# EAGLE design C64_Joyswitch_RF (EAGLE 9.5.2)
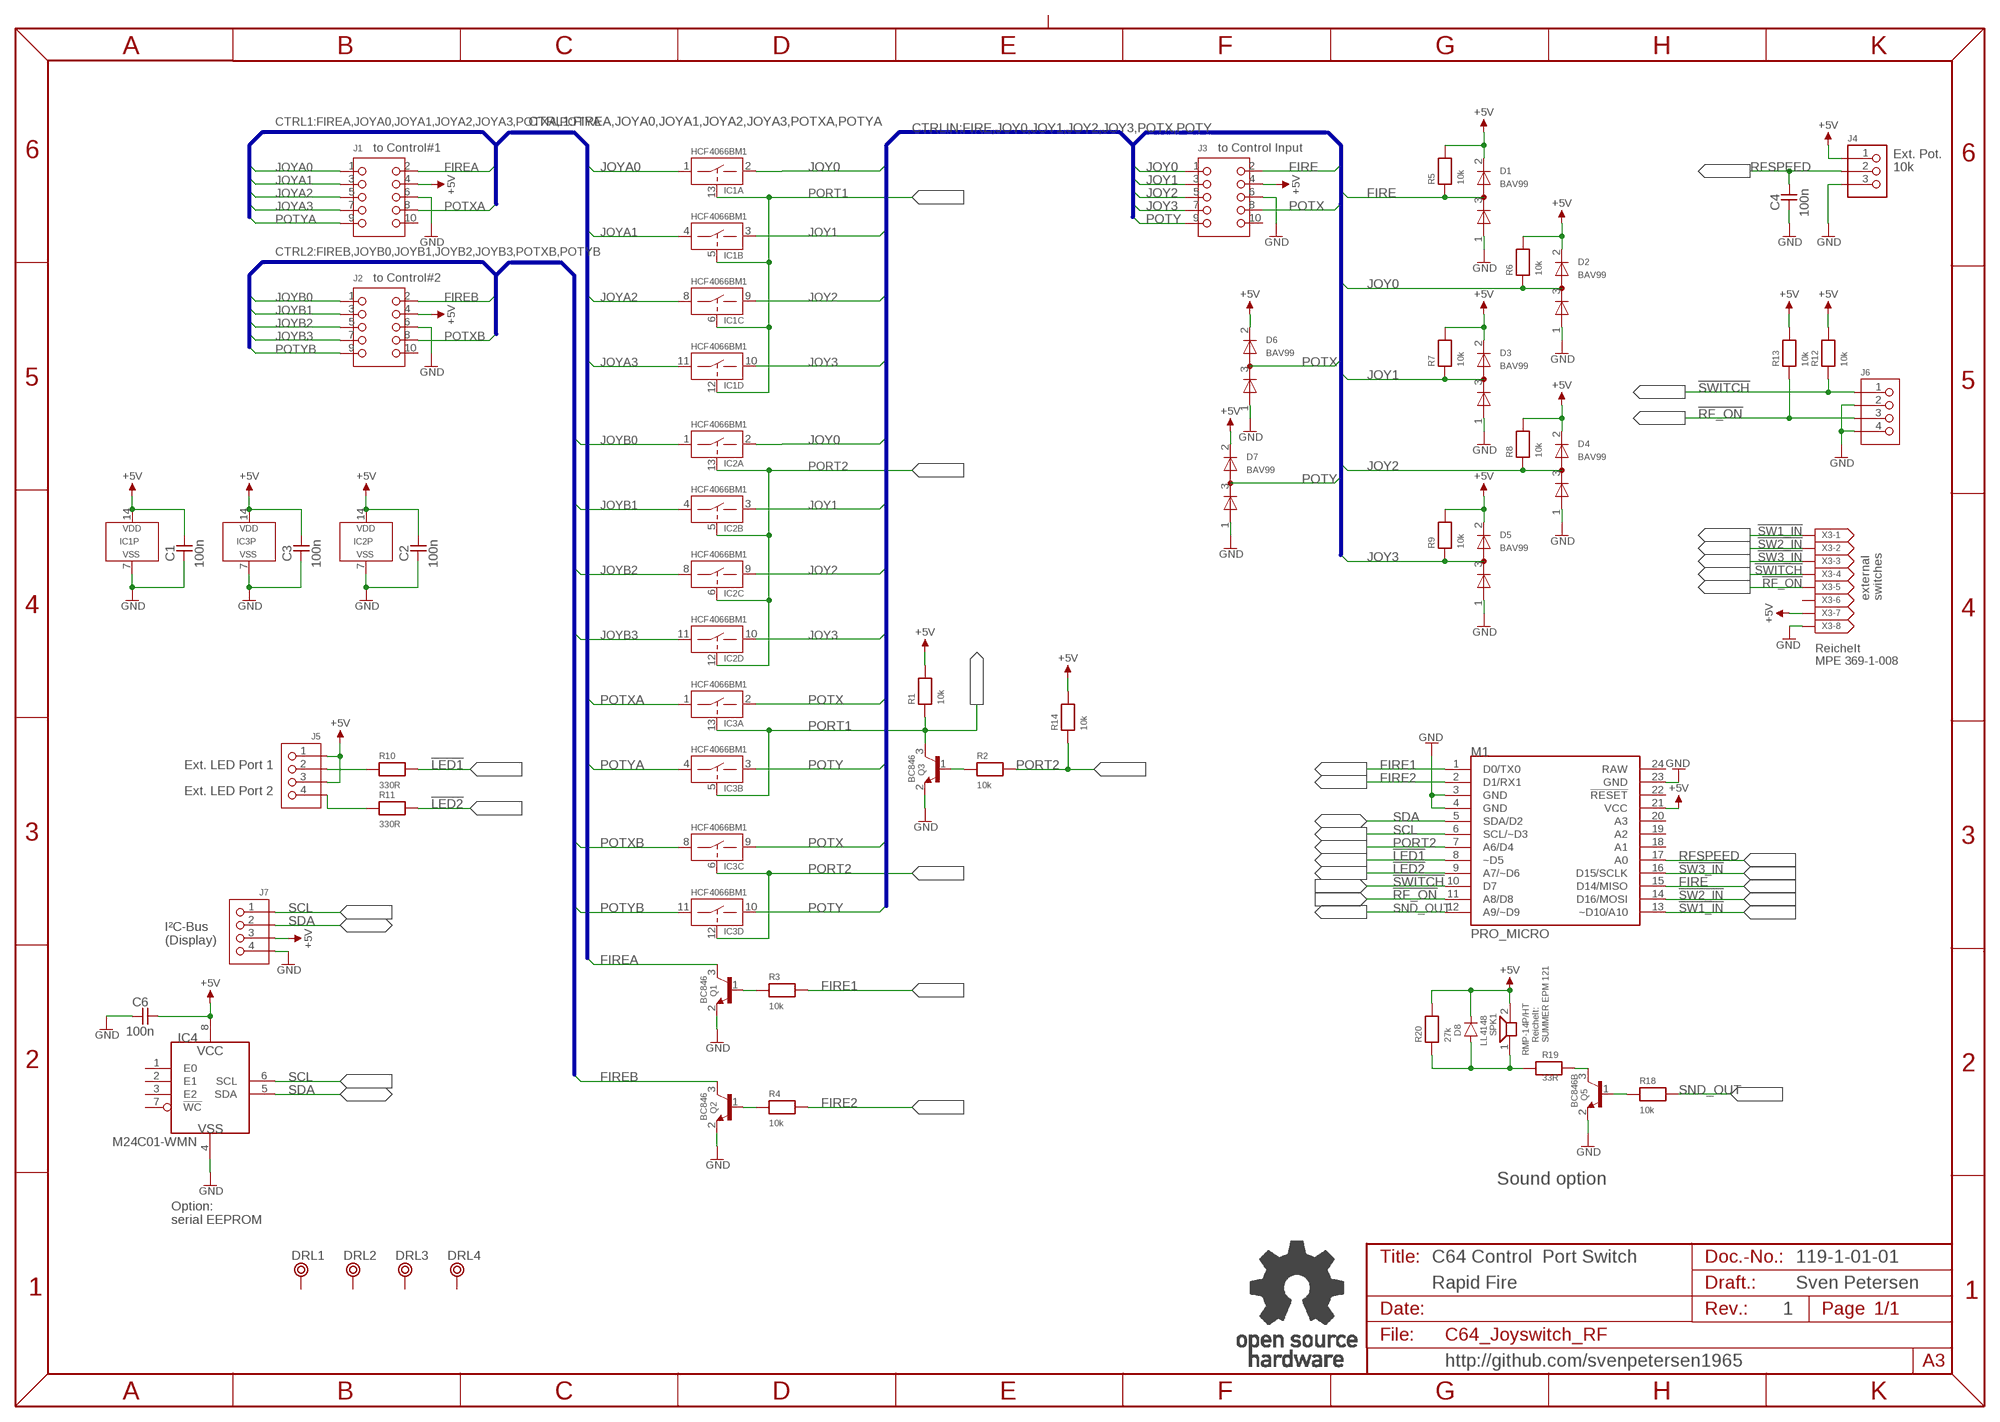
[diagram p0: schematic, sheet 1]

## Parts
C1  100n  C-0805  [0805]
C2  100n  C-0805  [0805]
C3  100n  C-0805  [0805]
C4  100n  C-0805  [0805]
C6  100n  C-0805  [0805]
D1  BAV99  D-BAV99  [SOT23]
D2  BAV99  D-BAV99  [SOT23]
D3  BAV99  D-BAV99  [SOT23]
D4  BAV99  D-BAV99  [SOT23]
D5  BAV99  D-BAV99  [SOT23]
D6  BAV99  D-BAV99  [SOT23]
D7  BAV99  D-BAV99  [SOT23]
D8  LL4148  [SOD80C]
DRL1  BOHR3,1  [BOHR3,1]
DRL2  BOHR3,1  [BOHR3,1]
DRL3  BOHR3,1  [BOHR3,1]
DRL4  BOHR3,1  [BOHR3,1]
IC1  HCF4066BM1  4066  [SO-14]
IC2  HCF4066BM1  4066  [SO-14]
IC3  HCF4066BM1  4066  [SO-14]
IC4  M24C01-WMN  M24CXX-WMN  [SO-08]
J1  2X05WV  [2X05WV]
J2  2X05WV  [2X05WV]
J3  2X05WV  [2X05WV]
J4  6410-3P  [6410-3P]
J5  6410-4P  [6410-4P]
J6  6410-4P  [6410-4P]
J7  6410-4P  [6410-4P]
M1  PRO_MICRO  [PRO_MICRO]
Q1  BC846  [SOT23]
Q2  BC846  [SOT23]
Q3  BC846  [SOT23]
Q5  BC846B  BC846  [SOT23]
R1  10k  R-0805  [0805]
R2  10k  R-0805  [0805]
R3  10k  R-0805  [0805]
R4  10k  R-0805  [0805]
R5  10k  R-0805  [0805]
R6  10k  R-0805  [0805]
R7  10k  R-0805  [0805]
R8  10k  R-0805  [0805]
R9  10k  R-0805  [0805]
R10  330R  R-0805  [0805]
R11  330R  R-0805  [0805]
R12  10k  R-0805  [0805]
R13  10k  R-0805  [0805]
R14  10k  R-0805  [0805]
R18  10k  R-0805  [0805]
R19  33R  R-0805  [0805]
R20  27k  R-0805  [0805]
SPK1  RMP-14P/HT  [RMP-14P/HT]
U$94  OPEN_SOURCE_HW  [OPENHW]
X3  369-1-008  MICMA08B  [MICMA08B]

## Nets
!LED1: M1.8(~D5) R10.2
!LED2: M1.9(A7/~D6) R11.2
!RF_ON: J6.3 M1.11(A8/D8) R13.1 X3.5
!SW1_IN: M1.13(~D10/A10) X3.1
!SW2_IN: M1.14(D16/MOSI) X3.2
!SW3_IN: M1.16(D15/SCLK) X3.3
!SWITCH: J6.1 M1.10(D7) R12.1 X3.4
+5V: C1.2 C2.2 C3.2 C6.2 D1.2(K) D2.2(K) D3.2(K) D4.2(K) D5.2(K) D6.2(K) D7.2(K) D8.K IC1.14(P:VDD) IC2.14(P:VDD) IC3.14(P:VDD) IC4.8(VCC) J1.4 J2.4 J3.4 J4.1 J5.1 J5.3 J7.3 M1.21(VCC) R1.2 R5.2 R6.2 R7.2 R8.2 R9.2 R12.2 R13.2 R14.2 R20.2 SPK1.2 X3.7
FIRE: D1.3(KA) J3.2 M1.15(D14/MISO) R5.1
FIRE1: M1.1(D0/TX0) R3.2
FIRE2: M1.2(D1/RX1) R4.2
FIREA: J1.2 Q1.3(C)
FIREB: J2.2 Q2.3(C)
GND: C1.1 C2.1 C3.1 C4.1 C6.1 D1.1(A) D2.1(A) D3.1(A) D4.1(A) D5.1(A) D6.1(A) D7.1(A) IC1.7(P:VSS) IC2.7(P:VSS) IC3.7(P:VSS) IC4.4(VSS) J1.6 J2.6 J3.6 J4.3 J6.2 J6.4 J7.4 M1.3(GND) M1.4(GND) M1.23(GND) Q1.2(E) Q2.2(E) Q3.2(E) Q5.2(E) X3.8
JOY0: D2.3(KA) IC1.2(A:B) IC2.2(A:B) J3.1 R6.1
JOY1: D3.3(KA) IC1.3(B:B) IC2.3(B:B) J3.3 R7.1
JOY2: D4.3(KA) IC1.9(C:B) IC2.9(C:B) J3.5 R8.1
JOY3: D5.3(KA) IC1.10(D:B) IC2.10(D:B) J3.7 R9.1
JOYA0: IC1.1(A:A) J1.1
JOYA1: IC1.4(B:A) J1.3
JOYA2: IC1.8(C:A) J1.5
JOYA3: IC1.11(D:A) J1.7
JOYB0: IC2.1(A:A) J2.1
JOYB1: IC2.4(B:A) J2.3
JOYB2: IC2.8(C:A) J2.5
JOYB3: IC2.11(D:A) J2.7
N$2: Q3.1(B) R2.1
N$3: Q1.1(B) R3.1
N$4: Q2.1(B) R4.1
N$5: J5.2 R10.1
N$6: J5.4 R11.1
N$8: Q5.1(B) R18.1
N$9: Q5.3(C) R19.2
N$10: D8.A R19.1 R20.1 SPK1.1
PORT1: IC1.5(B:EN) IC1.6(C:EN) IC1.12(D:EN) IC1.13(A:EN) IC3.5(B:EN) IC3.13(A:EN) Q3.3(C) R1.1
PORT2: IC2.5(B:EN) IC2.6(C:EN) IC2.12(D:EN) IC2.13(A:EN) IC3.6(C:EN) IC3.12(D:EN) M1.7(A6/D4) R2.2 R14.1
POTX: D6.3(KA) IC3.2(A:B) IC3.9(C:B) J3.8
POTXA: IC3.1(A:A) J1.8
POTXB: IC3.8(C:A) J2.8
POTY: D7.3(KA) IC3.3(B:B) IC3.10(D:B) J3.9
POTYA: IC3.4(B:A) J1.9
POTYB: IC3.11(D:A) J2.9
RFSPEED: C4.2 J4.2 M1.17(A0)
SCL: IC4.6(SCL) J7.1 M1.6(SCL/~D3)
SDA: IC4.5(SDA) J7.2 M1.5(SDA/D2)
SND_OUT: M1.12(A9/~D9) R18.2
Unconnected: DRL1.P$1 DRL2.P$1 DRL3.P$1 DRL4.P$1 IC4.1(E0) IC4.2(E1) IC4.3(E2) IC4.7(!WC) J1.10 J2.10 J3.10 M1.18(A1) M1.19(A2) M1.20(A3) M1.22(!RESET) X3.6

## Buses
CTRL1:FIREA,JOYA0,JOYA1,JOYA2,JOYA3,POTXA,POTYA
CTRL2:FIREB,JOYB0,JOYB1,JOYB2,JOYB3,POTXB,POTYB
CTRLIN:FIRE,JOY0,JOY1,JOY2,JOY3,POTX,POTY

## Notes on the sheet
- to Control#1 | to Control Input
- Ext. Pot.
- 10k
- to Control#2
- external
  switches
- Reichelt
  MPE 369-1-008
- Ext. LED Port 1
- Ext. LED Port 2
- I²C-Bus
  (Display)
- Reichelt:
  SUMMER EPM 121
- Sound option
- Option:
  serial EEPROM
- C64 Control  Port Switch | 119-1-01-01
- Rapid Fire | Sven Petersen
- 1
- http://github.com/svenpetersen1965

## Power pins joined to a net without a drawn wire
RAW: M1.24(RAW)

## Library data of the parts
C1-C4 C6 = SMD:C-0805
D1-D7 = Dioden:D-BAV99
D8 = Dioden:LL4148
DRL1-DRL4 = Mech_Bohr:BOHR3,1
IC1-IC3 = 40XXSMD:4066: Quadruple bilateral switches
IC4 = ST:M24CXX-W
J1-J3 = PINHEAD:2X05WV
J4 = MOLEX:6410-3P: 6410/22-27-2031
J5-J7 = MOLEX:6410-4P: 6410/22-27-2041
M1 = Arduino:PRO_MICRO
Q1-Q3 Q5 = Transistoren:BC846
R1-R14 R18-R20 = SMD:R-0805
SPK1 = KM:RMP-14P/HT
U$94 = Logo:OPEN_SOURCE_HW
X3 = AMP:MICMA08B

## Board
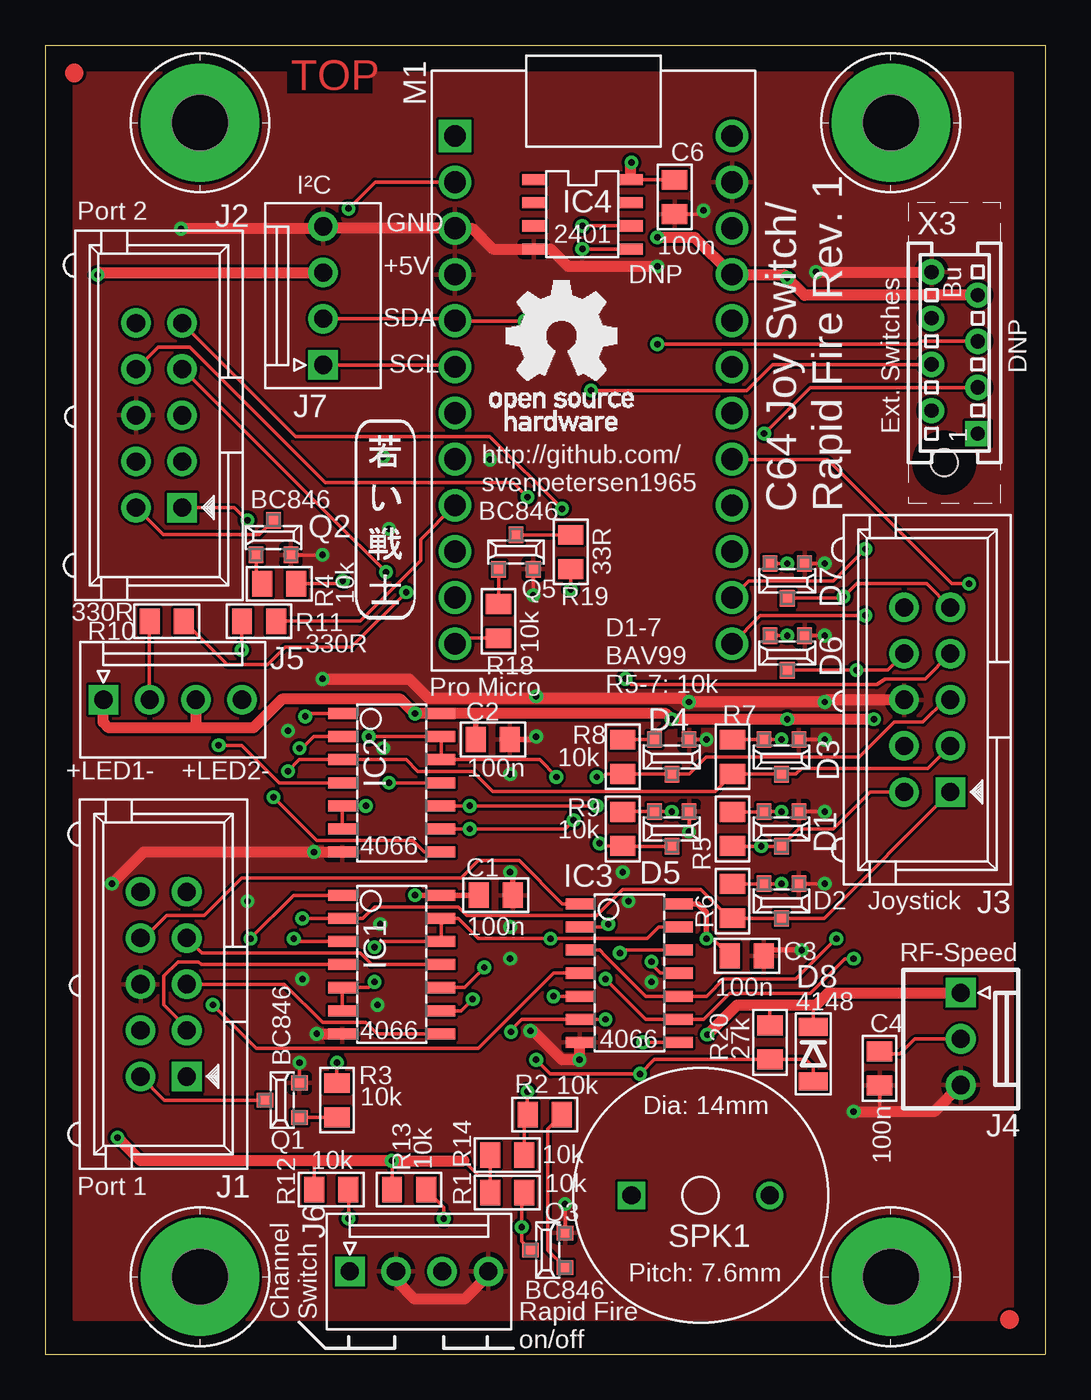
[diagram p1: board, top side]
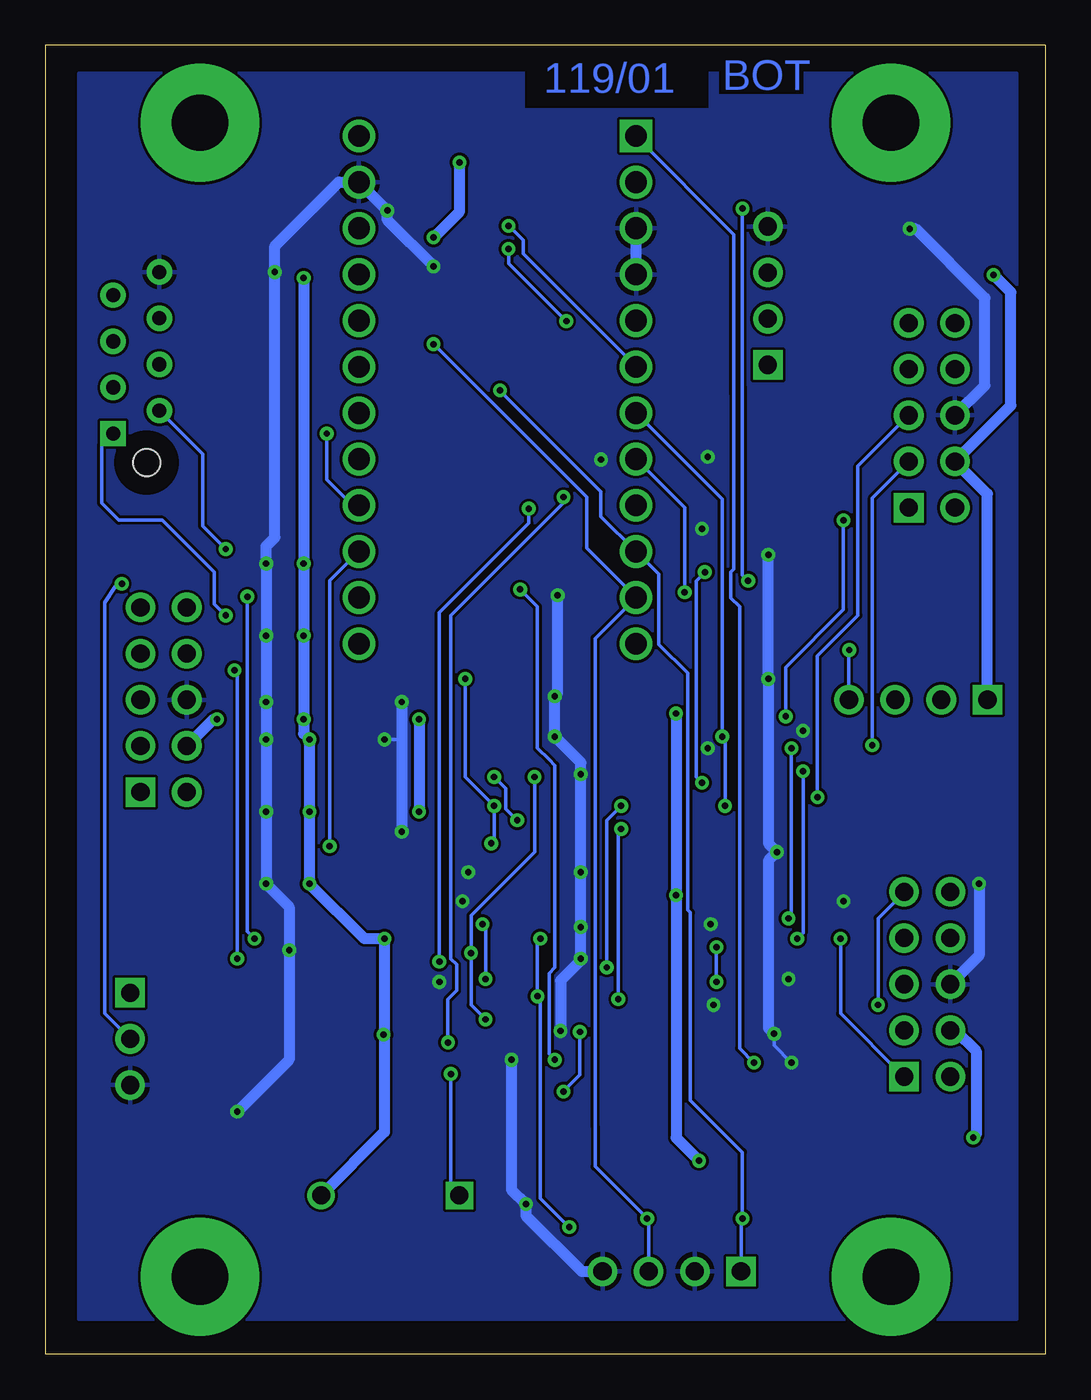
[diagram p2: board, bottom side, seen from below]

Size 55 x 72 mm. Coordinates in mm from the lower left corner, seen from the top.
Outline: 0,0 55,0 55,72 0,72 0,0
Copper layers (1*16): Top 0.035mm / dielectric 1.5mm / Bottom 0.035mm
Design rules "default *": minimum track width 6mil, minimum drill 0.35mm, track to track 6mil, track to pad 6mil, pad to pad 6mil, via to via 6mil, smd to smd 6mil, copper to edge 40mil, drill to drill 6mil, minimum pad ring 10mil, minimum via ring 8mil, stop-mask expansion 4mil, vias tented up to drill 24mil, thermal gap 10mil
bRestrict: 3 lines

### Footprints (pad centres in the part's own frame; a part is rotated, then mirrored left to right if it is on the bottom)
0805 = smd 1.092 x 1.397: 1 -0.94,0; 2 0.94,0
SOT23 = smd 0.8 x 0.9: 1 -0.953,-0.953; 2 0.953,-0.953; 3 0,0.953
SOD80C = smd 1 x 1.6: A -1.5,0; K 1.5,0
BOHR3,1 = drill 3.1 pad 6.502: P$1 0,0
SO-14 = smd 0.61 x 1.524: 1 -3.81,-2.731; 2 -2.54,-2.731; 3 -1.27,-2.731; 4 0,-2.731; 5 1.27,-2.731; 6 2.54,-2.731; 7 3.81,-2.731; 8 3.81,2.731; 9 2.54,2.731; 10 1.27,2.731; 11 0,2.731; 12 -1.27,2.731; 13 -2.54,2.731; 14 -3.81,2.731
SO-08 = smd 0.61 x 1.295: 1 -1.905,-2.667; 2 -0.635,-2.667; 3 0.635,-2.667; 4 1.905,-2.667; 5 1.905,2.667; 6 0.635,2.667; 7 -0.635,2.667; 8 -1.905,2.667
2X05WV = drill 1 pad 1.626 square: 1 -5.08,-1.27 | drill 1 pad 1.626: 2 -5.08,1.27; 3 -2.54,-1.27; 4 -2.54,1.27; 5 0,-1.27; 6 0,1.27; 7 2.54,-1.27; 8 2.54,1.27; 9 5.08,-1.27; 10 5.08,1.27
6410-3P = drill 1 pad 1.626 square: 1 -2.54,0 | drill 1 pad 1.626: 2 0,0; 3 2.54,0
6410-4P = drill 1 pad 1.626 square: 1 -3.81,0 | drill 1 pad 1.626: 2 -1.27,0; 3 1.27,0; 4 3.81,0
PRO_MICRO = drill 1.2 square: 1 -7.62,13.97 | drill 1.2: 2 -7.62,11.43; 3 -7.62,8.89; 4 -7.62,6.35; 5 -7.62,3.81; 6 -7.62,1.27; 7 -7.62,-1.27; 8 -7.62,-3.81; 9 -7.62,-6.35; 10 -7.62,-8.89; 11 -7.62,-11.43; 12 -7.62,-13.97; 13 7.62,-13.97; 14 7.62,-11.43; 15 7.62,-8.89; 16 7.62,-6.35; 17 7.62,-3.81; 18 7.62,-1.27; 19 7.62,1.27; 20 7.62,3.81; 21 7.62,6.35; 22 7.62,8.89; 23 7.62,11.43; 24 7.62,13.97
RMP-14P/HT = drill 1 square: 1 0,3.8 | drill 1: 2 0,-3.8
MICMA08B = drill 0.787 pad 1.397 square: 1 4.445,1.27 | drill 0.787 pad 1.397: 2 3.175,-1.27; 3 1.905,1.27; 4 0.635,-1.27; 5 -0.635,1.27; 6 -1.905,-1.27; 7 -3.175,1.27; 8 -4.445,-1.27 | hole 1.5: 6.032,-0.568

### Placement (x,y rotation side)
C1  24.77,25.24 180 top
C2  24.61,33.81 180 top
C3  38.58,21.91 180 top
C4  45.88,15.72 90 top
C6  34.61,63.66 90 top
D1  40.48,28.89 180 top
D2  40.48,24.92 180 top
D3  40.48,32.86 180 top
D4  34.45,32.86 180 top
D5  34.45,28.89 180 top
D6  40.8,38.58 180 top
D7  40.8,42.55 180 top
D8  42.23,16.51 90 top
DRL1  8.5,4.25 0 top
DRL2  46.5,4.25 0 top
DRL3  46.5,67.75 0 top
DRL4  8.5,67.75 0 top
IC1  19.05,21.43 270 top
IC2  19.05,31.43 270 top
IC3  32.12,20.96 270 top
IC4  29.53,62.71 270 top
J1  6.5,20.35 90 top
J2  6.25,51.65 90 top
J3  48.5,36 90 top
J4  50.34,17.34 270 top
J5  7,36 0 top
J6  20.55,4.55 0 top
J7  15.27,58.23 90 top
M1  30.14,53.05 0 top
Q1  13.02,13.97 90 top
Q2  12.54,44.93 0 top
Q3  27.62,5.71 90 top
Q5  25.88,44.13 0 top
R1  25.4,8.89 180 top
R2  27.46,13.18 180 top
R3  16.03,13.97 90 top
R4  12.86,42.39 0 top
R5  37.78,28.89 90 top
R6  37.78,24.92 90 top
R7  37.78,32.86 90 top
R8  31.75,32.86 90 top
R9  31.75,28.89 90 top
R10  6.67,40.32 0 top
R11  11.75,40.32 0 top
R12  15.72,9.05 180 top
R13  20,9.05 180 top
R14  25.4,10.95 180 top
R18  24.92,40.32 270 top
R19  28.89,44.13 90 top
R20  39.85,17.14 90 top
SPK1  36.04,8.73 90 top
U$65  [2LAYER]  13.49,69.53 0 top
U$66  [SMD_REF_R1MM]  1.59,70.48 0 top
U$67  [SMD_REF_R1MM]  53.02,1.91 0 top
U$68  [PCB-TITLE/]  0.16,81.6 0 top  (outside the outline)
U$93  [SVEN_TAG]  18.73,46.04 0 top
U$94  24.45,50.8 0 top
X3  50.01,55.09 270 top

### Tracks (layer width: path | path; a pad name or v marks a point on that pad's centre or on a via)
!LED1  (via drill 0.35)
  Top 0.203: R10.2 9.99,37.94 12.22,37.94 13.18,38.89 16.83,38.89 v19.84,41.91
  Bottom 0.203: v19.84,41.91 19.84,46.56 M1.8
!LED2
  Top 0.203: R11.2 17.3,40.32 20.64,43.66 20.64,44.82 M1.9
!RF_ON  (via drill 0.35)
  Top 0.203: v21.91,7.46 21.91,8.08 R13.1 | X3.5 48.1,55.72 47.94,55.56 v33.66,55.56
  Bottom 0.203: J6.3 21.82,7.38 v21.91,7.46 24.77,10.32 24.77,12.55 24.77,39.38 M1.11 25.24,44.34 25.24,47.15 v33.66,55.56
!SW1_IN  (via drill 0.35)
  Top 0.203: M1.13 39.32,40.64 v45.09,40.64
  Bottom 0.203: v45.09,40.64 45.72,41.27 45.72,43.02 48.58,45.88 50.96,45.88 51.91,46.83 51.91,50.01 X3.1
!SW2_IN  (via drill 0.35)
  Top 0.203: M1.14 38.69,42.55 43.34,42.55 v45.09,44.29
  Bottom 0.203: v45.09,44.29 46.35,45.56 46.35,49.53 X3.2
!SW3_IN  (via drill 0.35)
  Top 0.203: X3.3 42.07,53.18 v39.53,50.64
  Bottom 0.203: v39.53,50.64 39.53,48.1 38.13,46.7 M1.16
!SWITCH  (via drill 0.35)
  Top 0.203: v16.67,7.46 16.67,9.04 R12.1 | X3.4 40.01,54.45 38.58,53.02 v30,53.02
  Bottom 0.203: J6.1 16.74,7.39 v16.67,7.46 16.67,11.11 19.53,13.97 19.53,24.29 19.68,24.45 19.68,37.47 21.27,39.05 21.27,42.91 M1.10 24.45,46.09 24.45,47.47 v30,53.02
+5V  (via drill 0.35)
  Top 0.203: D7.2 v40.8,43.5 | v40.8,39.53 D6.2 | v40.48,25.88 D2.2 37.8,25.88 R6.2 | v40.48,29.84 D1.2 39.52,29.83 R5.2 | v40.48,33.81 D3.2 R7.2 | v34.45,34.92 33.5,33.97 D4.2 31.76,33.81 R8.2 | v34.45,29.84 D5.2 31.76,29.84 R9.2 | R13.2 19.06,10.64 | IC4.8 34.59,64.61 C6.2 | R20.2 39.85,19.21 | D8.K 42.23,19.21 | C3.2 36.68,22.86 v36.35,22.86 | 24.46,9.84 23.81,9.84 23.02,10.64 | R14.2 24.46,9.84 | R1.2 24.46,9.84 | R12.2 14.78,10.62 14.76,10.64
  Top 0.305: C2.2 23.67,35.23 23.65,35.24 | C1.2 IC1.14 v20.32,25.24 | v36.35,22.86 36.35,24.29 35.87,24.77 IC3.14
  Top 0.61: v45.56,34.92 43.5,34.92 v40.8,34.92 v34.45,34.92 34.13,35.24 23.65,35.24 IC2.14 v20.32,35.24 19.53,36.04 13.02,36.04 11.43,34.45 8.26,34.45 | 8.26,34.45 3.49,34.45 3.17,34.77 3.19,34.78 J5.1 | J5.3 8.27,34.46 8.26,34.45 | v3.97,11.91 5.24,10.64 5.4,10.64 14.76,10.64 v19.05,10.64 19.06,10.64 23.02,10.64 | 40.61,59.4 M1.21 35.72,61.44 v33.66,61.44 | 40.61,59.4 v40.8,59.21 | X3.7 41.75,58.26 40.61,59.4 | v2.86,59.37 2.99,59.5 J7.3 | IC4.8 32.19,65.53 v32.23,65.56 | v36.4,17.57 38.04,19.21 39.85,19.21 42.23,19.21 42.39,19.21 43.06,19.88 J4.1
  Bottom 0.203: 36.35,17.62 v36.4,17.57
  Bottom 0.61: v34.45,34.92 v34.45,29.84 | J3.4 45.77,34.92 v45.56,34.92 | v20.32,35.24 v20.32,25.24 20.32,11.91 v19.05,10.64 | J1.4 4.95,17.81 3.81,16.67 3.81,12.06 v3.97,11.91 | J5.1 3.19,47.32 J2.4 1.91,52.19 1.91,58.42 v2.86,59.37 | v40.8,59.21 v40.8,43.5 v40.8,39.53 v40.8,34.92 40.8,34.13 v40.48,33.81 v40.48,29.84 v40.48,25.88 37.47,22.86 v36.35,22.86 36.35,17.94 36.35,17.62 36.35,12.21 SPK1.2 | v33.66,61.44 32.23,62.87 v32.23,65.56
FIRE  (via drill 0.35)
  Top 0.203: R5.1 37.8,27.94 v39.37,27.94 D1.3 41.43,28.89 43.34,28.89 45.37,30.92 J3.2
  Bottom 0.203: v39.37,27.94 39.37,42.55 M1.15
FIRE1  (via drill 0.35)
  Top 0.203: v16.03,16.03 R3.2
  Bottom 0.203: v16.03,16.03 16.83,16.83 16.83,41.12 17.3,41.59 17.3,43.02 17.14,43.18 17.14,52.86 17.14,61.59 22.52,66.97 M1.1
FIRE2  (via drill 0.35)
  Top 0.203: R4.2 16.19,42.39 v16.35,42.55 | v16.67,63.02 18.12,64.48 M1.2
  Bottom 0.203: v16.35,42.55 16.67,42.86 16.67,53.18 v16.67,63.02
FIREA
  Top 0.203: Q1.3 6.53,13.97 J1.2
FIREB
  Top 0.203: Q2.3 11.75,45.09 6.46,45.09 J2.2
GND  (via drill 0.35)
  Top 0.152: v13.97,16.03 Q1.2
  Top 0.203: D7.1 v42.86,43.5 | v42.86,39.53 D6.1 | v42.86,33.81 D3.1 | D2.1 v42.86,25.88 | D1.1 v42.86,29.84 | D4.1 v36.35,33.81 | v35.4,28.73 D5.1 | C4.1 45.88,13.34 | v15.24,43.97 Q2.2 | v36.2,62.91 36,62.72 C6.1 | Q3.2 v28.57,8.26 | v26.83,41.75 Q5.2
  Top 0.305: C1.1 25.7,26.36 v25.56,26.51 | C2.1 26.83,33.81 v26.99,33.97 | C3.1 39.83,22.23 v41.59,22.23
  Top 0.61: J3.6 42.98,36 v42.86,35.88 41.27,35.88 v35.4,35.88 35.24,35.88 35.04,36.08 26.99,36.08 | 26.99,36.08 21.07,36.08 20.03,37.12 15.27,37.12 v15.24,37.15 | J4.3 48.88,13.34 45.88,13.34 v44.45,13.34 | IC3.7 29.39,16.21 v29.37,16.19 28.42,16.19 26.83,17.78 v26.67,17.78 | J6.2 19.28,4.05 20.32,3.02 23.04,3.02 24.36,4.34 J6.4 | IC2.7 v14.76,27.62 5.4,27.62 v3.65,25.88 | v14.92,17.62 IC1.7 | v42.39,59.53 X3.8 | 15.37,61.94 M1.3 23.47,61.94 24.61,60.8 IC4.4 27.78,60.8 28.73,59.85 v33.66,59.85 | 15.37,61.94 J7.4 | v7.46,61.91 7.49,61.94 15.37,61.94 | v26.99,36.2 26.99,36.08
  Bottom 0.203: v36.35,33.81 D4.1 | v14.92,17.62 14.92,16.99 v13.97,16.03
  Bottom 0.61: v35.4,35.88 D4.1 v35.4,28.73 | v14.92,17.62 15.24,17.94 15.24,27.15 v14.76,27.62 15.24,28.1 v15.24,37.15 v15.24,43.97 | J1.6 3.65,21.93 v3.65,25.88 | M1.4 M1.3 | J2.6 3.33,53.3 3.33,58.1 7.14,61.91 v7.46,61.91 | v33.66,59.85 36.2,62.39 v36.2,62.91 M1.23 38.87,64.48 42.39,60.96 v42.39,59.53 42.39,44.93 42.86,44.45 v42.86,43.5 v42.86,39.53 v42.86,35.88 v42.86,33.81 v42.86,29.84 v42.86,25.88 41.59,24.61 v41.59,22.23 41.59,16.19 v44.45,13.34 | v29.37,16.19 29.37,9.05 v28.57,8.26 28.57,7.62 25.5,4.55 J6.4 | v26.83,41.75 26.83,36.35 v26.99,36.2 v26.99,33.97 25.56,32.54 v25.56,26.51 25.56,21.66 26.67,20.55 v26.67,17.78
  other vias: 18.57,49.37 24.45,49.21 18.89,45.4 11.11,24.92 25.56,21.75 18.26,19.21 25.56,31.91 18.41,23.65 14.13,20.64 31.75,26.51 32.07,24.92 25.56,23.5 13.34,34.29 18.57,33.34 33.34,20.48
  pour Bottom: 1.59,70.48 1.59,1.91 53.18,1.91 53.18,70.48
  pour Top: 1.59,70.48 53.18,70.48 53.18,1.91 1.59,1.91
JOY0  (via drill 0.35)
  Top 0.203: IC2.2 14.76,33.97 14.13,33.34 v13.97,33.34 | v14.13,23.97 IC1.2 17.46,23.97 18.1,24.61 22.7,24.61 23.02,24.28 23.16,24.14 30.33,24.14 31.75,25.56 36.04,25.56 37.61,23.98 R6.1 37.8,23.97 D2.3 42.82,23.97 J3.1
  Bottom 0.203: v13.97,33.34 13.97,33.18 13.97,24.13 v14.13,23.97
JOY1  (via drill 0.35)
  Top 0.203: J3.3 48.54,32.23 41.59,32.23 41.27,31.91 D3.3 37.8,31.91 | 37.8,31.91 R7.1 | 37.8,31.91 36.84,30.96 24.61,30.96 23.5,32.07 20.48,32.07 19.84,32.7 IC2.3 13.97,32.7 v13.34,32.07 | v13.65,22.86 13.65,22.83 13.78,22.7 IC1.3
  Bottom 0.203: v13.34,32.07 13.34,23.18 v13.65,22.86
JOY2  (via drill 0.35)
  Top 0.203: J3.5 49.49,36 48.26,34.77 46.67,34.77 44.77,32.86 36.35,32.86 35.4,31.91 D4.3 34.44,31.92 R8.1 30.81,31.92 30.64,31.75 v30.32,31.75 | IC1.9 22.86,18.89 v23.5,19.53 | IC2.9 v23.34,28.89 28.57,28.89 v29.05,29.37
  Bottom 0.203: v23.5,19.53 23.5,28.73 v23.34,28.89 | v30.32,31.75 29.69,31.11 29.69,30 v29.05,29.37
JOY3  (via drill 0.35)
  Top 0.203: J3.7 48.38,37.15 46.2,37.15 45.72,36.83 35.56,36.83 32.23,36.83 v31.91,37.15 | v30.48,28.1 30.63,27.95 R9.1 31.76,27.94 D5.3 | IC2.10 v23.34,30.16 29.69,30.16 v30.32,30.16 | IC1.10 23.05,20.16 24.13,21.24 v24.13,21.27
  Bottom 0.203: v31.91,37.15 31.91,31.75 v30.32,30.16 30.32,28.26 v30.48,28.1 | v24.13,21.27 24.13,29.37 v23.34,30.16
JOYA0  (via drill 0.35)
  Top 0.203: v11.27,22.86 13.65,25.24 IC1.1
  Bottom 0.203: v11.27,22.86 11.27,18.73 7.81,15.27 J1.1
JOYA1
  Top 0.203: IC1.4 8.57,21.43 8.41,21.59 7.3,21.59 6.51,20.8 6.51,19.21 7.77,17.95 J1.3
JOYA2
  Top 0.203: IC1.8 18.26,17.62 17.62,18.26 15.24,18.26 13.15,20.35 J1.5
JOYA3
  Top 0.203: IC1.11 17.94,21.43 17.3,22.07 8.59,22.07 J1.7
JOYB0  (via drill 0.35)
  Top 0.203: v14.29,35.08 14.45,35.24 IC2.1 | v11.11,45.88 11.07,45.88 10.38,46.57 J2.1
  Bottom 0.203: v14.29,35.08 14.29,37.78 11.11,40.96 v11.11,45.88
JOYB1  (via drill 0.35)
  Top 0.203: IC2.4 12.86,31.43 10.79,33.5 v9.53,33.5
  Bottom 0.203: v9.53,33.5 9.53,47.1 J2.3
JOYB2  (via drill 0.35)
  Top 0.203: IC2.8 20.83,27.62 20.19,28.26 14.92,28.26 v12.54,30.64
  Bottom 0.203: J2.5 10.32,48.85 10.32,40.64 12.54,38.42 v12.54,30.64
JOYB3  (via drill 0.35)
  Top 0.203: IC2.11 19.68,31.43 v18.89,31.43 | v18.73,43.02 15.72,46.04 7.56,54.19 J2.7
  Bottom 0.203: v18.89,31.43 19.21,31.75 19.21,42.55 v18.73,43.02
N$2
  Top 0.203: Q3.1 27.62,5.71 27.62,12.39 R2.1
N$3
  Top 0.203: Q1.1 16.02,13.02 R3.1
N$4
  Top 0.203: R4.1 11.59,42.72 Q2.1
N$5
  Top 0.203: R10.1 5.71,40.31 5.71,36.02 J5.2
N$6  (via drill 0.35)
  Top 0.203: v10.79,38.73 10.79,40.31 R11.1
  Bottom 0.203: J5.4 10.81,38.72 v10.79,38.73
N$8
  Top 0.203: R18.1 Q5.1
N$9
  Top 0.203: Q5.3 25.89,45.07 R19.2
N$10  (via drill 0.35)
  Top 0.203: D8.A 42.23,15.8 41.83,16.2 R20.1 33.5,16.2 v32.7,15.41 27.77,15.41 v26.99,16.19 | R19.1 v28.89,42.07
  Bottom 0.203: v32.7,15.41 32.71,15.4 32.71,9.21 SPK1.1 | v28.89,42.07 27.94,41.12 27.94,33.34 27.3,32.7 26.99,32.38 26.99,24.13 26.99,21.27 27.3,20.95 27.3,16.51 v26.99,16.19
PORT1  (via drill 0.35)
  Top 0.203: IC3.13 33.74,23.5 33.1,22.86 v27.79,22.86 v27.78,22.86 23.81,22.86 23.18,23.5 22.7,23.97 IC1.13 IC1.12 18.41,22.7 v18.1,22.38 | IC3.5 v27.94,19.68 | IC1.6 IC1.5 17.78,20.16 v18.1,20.48 | R1.1 26.19,8.74 v26.19,6.99 26.19,6.19 Q3.3
  Bottom 0.203: v27.78,22.86 27.78,22.7 27.94,22.54 v27.94,19.68 27.78,19.53 27.78,8.57 v26.19,6.99 | v18.1,22.38 v18.1,20.48
PORT2  (via drill 0.35)
  Top 0.203: v30.8,18.41 v30.79,18.42 IC3.6 26.2,18.42 25.56,17.78 v25.61,17.73 | v31.59,22.07 31.75,22.23 IC3.12 | IC2.6 IC2.5 v17.62,30.16 | v17.78,33.97 IC2.13 IC2.12 27.18,32.7 28.1,31.78 v28.1,31.75 | R14.1 26.34,12.99 R2.2 v26.51,14.45
  Bottom 0.203: v30.8,18.41 31.59,19.21 v31.59,22.07 31.59,24.13 28.1,27.62 v28.1,31.75 | v17.62,30.16 17.62,33.81 v17.78,33.97 17.78,47.04 M1.7 | v25.61,17.73 25.61,15.35 v26.51,14.45
POTX  (via drill 0.35)
  Top 0.203: J3.8 46.31,37.62 v44.61,37.62 D6.3 | v30.8,20.64 33.02,18.42 34.61,18.42 IC3.9 36.2,18.42 37.62,19.84 42.07,19.84 43.97,21.75 v44.45,21.75 | v30.96,23.65 30.8,23.5 IC3.2
  Bottom 0.203: v30.96,23.65 30.8,23.5 v30.8,20.64 | v44.61,37.62 44.45,37.47 v44.45,21.75
POTXA
  Top 0.203: IC3.1 28.43,24.77 26.06,27.15 23.81,27.15 22.86,26.19 10.79,26.19 8.73,24.13 6.67,24.13 5.43,22.89 J1.8
POTXB  (via drill 0.35)
  Top 0.203: IC3.8 v32.86,17.14 | J2.8 6.19,55.4 7.94,55.4 15.4,47.94 25.72,47.94 v26.51,47.15
  Bottom 0.203: v26.51,47.15 26.51,46.83 32.7,40.64 32.7,21.75 32.38,21.43 32.38,20 32.86,19.53 v32.86,17.14
POTY  (via drill 0.35)
  Top 0.203: J3.9 48.46,42.39 44.61,42.39 v43.89,41.67 43.81,41.59 D7.3 | IC3.3 30.48,22.23 30.8,21.91 33.02,19.69 IC3.10 36.36,19.69 37.31,20.64 41.27,20.64 v43.5,22.86
  Bottom 0.203: v43.5,22.86 43.89,23.26 43.89,23.34 v43.89,41.67
POTYA  (via drill 0.35)
  Top 0.203: v9.21,19.21 11.59,16.83 14.92,16.83 23.81,16.83 26.51,19.53 27.94,20.96 IC3.4
  Bottom 0.203: J1.9 7.77,25.41 9.21,23.97 9.21,19.53 9.37,19.37 v9.21,19.21
POTYB  (via drill 0.35)
  Top 0.203: IC3.11 33.81,20.96 33.34,21.43 v33.34,21.59 | J2.9 13.77,50.48 16.83,50.48 20.64,50.48 24.45,50.48 v28.42,46.51
  Bottom 0.203: v28.42,46.51 28.42,45.72 33.34,40.8 v33.34,21.59
RFSPEED  (via drill 0.35)
  Top 0.203: J4.2 47.82,17.34 46.99,16.51 46.02,16.51 C4.2 | v50.8,42.39 49.85,42.39 43.02,49.21 37.79,49.21 M1.17
  Bottom 0.203: J4.2 51.75,18.75 51.75,41.35 51.17,42.23 v50.8,42.39
SCL  (via drill 0.35)
  Top 0.203: J7.1 22.42,54.42 M1.6 | IC4.6 v29.53,62.07
  Bottom 0.203: v29.53,62.07 28.73,61.28 28.73,60.53 M1.6
SDA  (via drill 0.35)
  Top 0.203: J7.2 22.42,56.96 M1.5 22.55,56.83 v26.35,56.83 | IC4.5 30.48,60.8 v29.53,60.8
  Bottom 0.203: v29.53,60.8 29.53,60.01 v26.35,56.83
SND_OUT
  Top 0.203: M1.12 22.82,39.38 R18.2

### Text on the board
Bottom: 119/01
tPlace: I²C | Port 2 | GND | 2401 | 100n | +5V | DNP | SDA | SCL | DNP | Ext. Switches | BC846 | http://github.com/ / svenpetersen1965 | BC846 | C64 Joy Switch/ / Rapid Fire Rev. 1 | 33R | 10k | 330R | 330R | 10k | D1-7 / BAV99 | Pro Micro | R5-7: 10k | 10k | +LED1- | +LED2- | 100n | 10k | 4066 | Joystick | 100n | RF-Speed | 100n | 4148 | 4066 | 4066 | BC846 | 27k | 10k | 10k | Dia: 14mm | 10k | 10k | 10k | 100n | Port 1 | 10k | Pitch: 7.6mm | BC846 | Channel / Switch | Rapid Fire / on/off
Measures: 4- 3.1
Document: Sven Petersen | 119-2-01-01 | 2019 | 35µm | 2 | 1